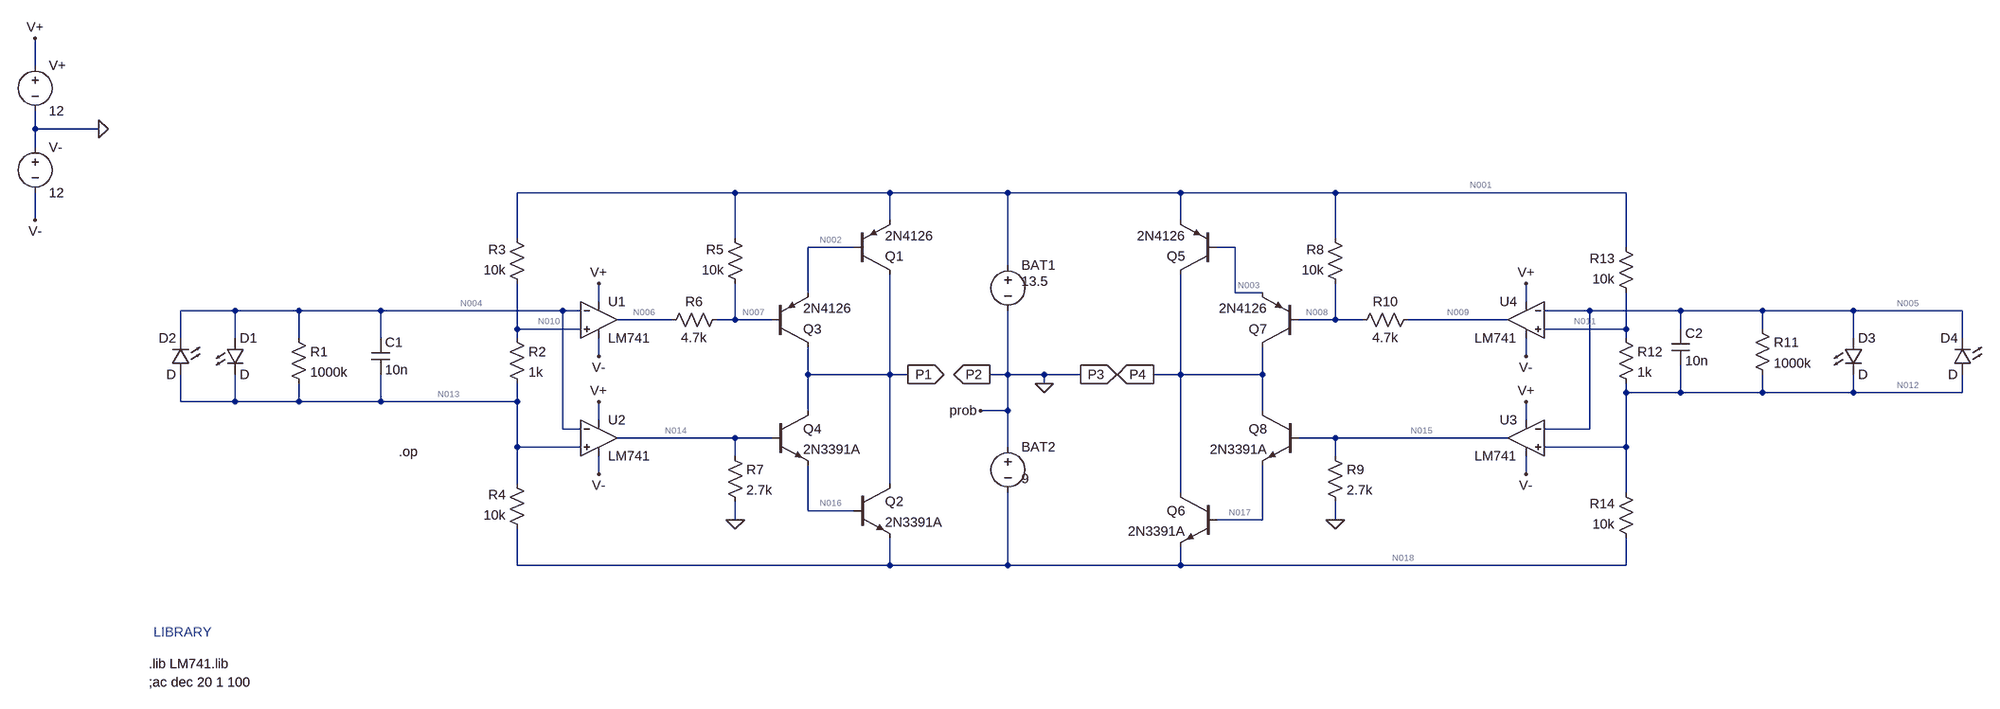
[diagram p0: schematic solar tracker.asc]
solar tracker.asc, the LTspice schematic file:
Version 4
SHEET 1 2612 828
WIRE -800 -416 -800 -464
WIRE -800 -304 -800 -336
WIRE -688 -304 -800 -304
WIRE -800 -272 -800 -304
WIRE 432 -192 48 -192
WIRE 704 -192 432 -192
WIRE 912 -192 704 -192
WIRE 1216 -192 912 -192
WIRE 1488 -192 1216 -192
WIRE 2000 -192 1488 -192
WIRE -800 -144 -800 -192
WIRE 704 -144 704 -192
WIRE 1216 -144 1216 -192
WIRE 48 -112 48 -192
WIRE 432 -112 432 -192
WIRE 1488 -112 1488 -192
WIRE 640 -96 560 -96
WIRE 1312 -96 1280 -96
WIRE 2000 -96 2000 -192
WIRE 912 -64 912 -192
WIRE 560 -16 560 -96
WIRE 1312 -16 1312 -96
WIRE 1360 -16 1312 -16
WIRE 192 0 192 -32
WIRE 1824 0 1824 -32
WIRE -448 16 -544 16
WIRE -336 16 -448 16
WIRE -192 16 -336 16
WIRE 128 16 -192 16
WIRE 160 16 128 16
WIRE 1936 16 1856 16
WIRE 2096 16 1936 16
WIRE 2240 16 2096 16
WIRE 2400 16 2240 16
WIRE 2592 16 2400 16
WIRE 320 32 224 32
WIRE 432 32 432 -32
WIRE 432 32 400 32
WIRE 496 32 432 32
WIRE 1488 32 1488 -32
WIRE 1488 32 1424 32
WIRE 1536 32 1488 32
WIRE 1792 32 1616 32
WIRE 48 48 48 -32
WIRE 160 48 48 48
WIRE 2000 48 2000 -16
WIRE 2000 48 1856 48
WIRE 2096 48 2096 16
WIRE 2240 48 2240 16
WIRE -544 64 -544 16
WIRE -448 64 -448 16
WIRE -336 64 -336 16
WIRE -192 64 -192 16
WIRE 48 64 48 48
WIRE 2000 64 2000 48
WIRE 2400 64 2400 16
WIRE 2592 64 2592 16
WIRE 192 96 192 64
WIRE 1824 96 1824 64
WIRE 560 128 560 80
WIRE 704 128 704 -48
WIRE 704 128 560 128
WIRE 736 128 704 128
WIRE 912 128 912 16
WIRE 912 128 880 128
WIRE 976 128 912 128
WIRE 1040 128 976 128
WIRE 1216 128 1216 -48
WIRE 1216 128 1168 128
WIRE 1360 128 1360 80
WIRE 1360 128 1216 128
WIRE 976 144 976 128
WIRE 2000 160 2000 144
WIRE 2096 160 2096 112
WIRE 2096 160 2000 160
WIRE 2240 160 2240 128
WIRE 2240 160 2096 160
WIRE 2400 160 2400 128
WIRE 2400 160 2240 160
WIRE 2592 160 2592 128
WIRE 2592 160 2400 160
WIRE -544 176 -544 128
WIRE -448 176 -448 128
WIRE -448 176 -544 176
WIRE -336 176 -336 144
WIRE -336 176 -448 176
WIRE -192 176 -192 128
WIRE -192 176 -336 176
WIRE 48 176 48 144
WIRE 48 176 -192 176
WIRE 560 192 560 128
WIRE 912 192 912 128
WIRE 912 192 864 192
WIRE 1360 192 1360 128
WIRE 192 208 192 176
WIRE 1824 208 1824 176
WIRE 128 224 128 16
WIRE 160 224 128 224
WIRE 1936 224 1936 16
WIRE 1936 224 1856 224
WIRE 432 240 224 240
WIRE 496 240 432 240
WIRE 1488 240 1424 240
WIRE 1792 240 1488 240
WIRE 48 256 48 176
WIRE 160 256 48 256
WIRE 912 256 912 192
WIRE 2000 256 2000 160
WIRE 2000 256 1856 256
WIRE 432 272 432 240
WIRE 1488 272 1488 240
WIRE 192 304 192 272
WIRE 1824 304 1824 272
WIRE 48 320 48 256
WIRE 704 320 704 128
WIRE 1216 336 1216 128
WIRE 2000 336 2000 256
WIRE 560 368 560 288
WIRE 640 368 560 368
WIRE 432 384 432 352
WIRE 1360 384 1360 288
WIRE 1360 384 1280 384
WIRE 1488 384 1488 352
WIRE 48 464 48 400
WIRE 704 464 704 416
WIRE 704 464 48 464
WIRE 912 464 912 336
WIRE 912 464 704 464
WIRE 1216 464 1216 432
WIRE 1216 464 912 464
WIRE 2000 464 2000 416
WIRE 2000 464 1216 464
FLAG -800 -464 V+
FLAG -800 -144 V-
FLAG -688 -304 0
FLAG 192 96 V-
FLAG 192 304 V-
FLAG 192 -32 V+
FLAG 192 176 V+
FLAG 432 384 0
FLAG 976 144 0
FLAG 736 128 P1
IOPIN 736 128 Out
FLAG 880 128 P2
IOPIN 880 128 Out
FLAG 1040 128 P3
IOPIN 1040 128 Out
FLAG 1168 128 P4
IOPIN 1168 128 Out
FLAG 1488 384 0
FLAG 1824 -32 V+
FLAG 1824 176 V+
FLAG 1824 96 V-
FLAG 1824 304 V-
FLAG 864 192 prob
SYMBOL res -352 48 R0
SYMATTR InstName R1
SYMATTR Value 1000k
SYMBOL cap -208 64 R0
SYMATTR InstName C1
SYMATTR Value 10n
SYMBOL Opamps\\opamp2 192 -32 R0
SYMATTR InstName U1
SYMATTR Value LM741
SYMBOL Opamps\\opamp2 192 176 R0
SYMATTR InstName U2
SYMATTR Value LM741
SYMBOL res 416 16 R90
WINDOW 0 0 56 VBottom 2
WINDOW 3 32 56 VTop 2
SYMATTR InstName R6
SYMATTR Value 4.7k
SYMBOL res 448 -16 R180
WINDOW 0 36 76 Left 2
WINDOW 3 36 40 Left 2
SYMATTR InstName R5
SYMATTR Value 10k
SYMBOL res 64 -16 R180
WINDOW 0 36 76 Left 2
WINDOW 3 36 40 Left 2
SYMATTR InstName R3
SYMATTR Value 10k
SYMBOL voltage -800 -432 R0
SYMATTR InstName V+
SYMATTR Value 12
SYMBOL voltage -800 -288 R0
SYMATTR InstName V-
SYMATTR Value 12
SYMBOL pnp 496 80 M180
SYMATTR InstName Q3
SYMATTR Value 2N4126
SYMBOL res 416 256 R0
SYMATTR InstName R7
SYMATTR Value 2.7k
SYMBOL npn 496 192 R0
SYMATTR InstName Q4
SYMATTR Value 2N3391A
SYMBOL pnp 640 -48 M180
SYMATTR InstName Q1
SYMATTR Value 2N4126
SYMBOL npn 640 320 R0
SYMATTR InstName Q2
SYMATTR Value 2N3391A
SYMBOL voltage 912 -80 R0
WINDOW 3 24 44 Left 2
WINDOW 123 24 44 Left 2
WINDOW 39 0 0 Left 2
SYMATTR Value 13.5
SYMATTR InstName BAT1
SYMBOL voltage 912 240 R0
WINDOW 3 24 72 Left 2
WINDOW 123 24 44 Left 2
WINDOW 39 0 0 Left 2
SYMATTR Value 9
SYMATTR InstName BAT2
SYMBOL res 64 416 R180
WINDOW 0 36 76 Left 2
WINDOW 3 36 40 Left 2
SYMATTR InstName R4
SYMATTR Value 10k
SYMBOL LED -464 64 R0
SYMATTR InstName D1
SYMBOL LED -528 128 R180
WINDOW 0 24 64 Left 2
WINDOW 3 24 0 Left 2
SYMATTR InstName D2
SYMBOL res 32 48 R0
SYMATTR InstName R2
SYMATTR Value 1k
SYMBOL pnp 1280 -48 R180
SYMATTR InstName Q5
SYMATTR Value 2N4126
SYMBOL pnp 1424 80 R180
SYMATTR InstName Q7
SYMATTR Value 2N4126
SYMBOL npn 1424 192 M0
SYMATTR InstName Q8
SYMATTR Value 2N3391A
SYMBOL npn 1280 336 M0
SYMATTR InstName Q6
SYMATTR Value 2N3391A
SYMBOL res 1504 -16 R180
WINDOW 0 36 76 Left 2
WINDOW 3 36 40 Left 2
SYMATTR InstName R8
SYMATTR Value 10k
SYMBOL res 1472 256 R0
SYMATTR InstName R9
SYMATTR Value 2.7k
SYMBOL res 1632 16 R90
WINDOW 0 0 56 VBottom 2
WINDOW 3 32 56 VTop 2
SYMATTR InstName R10
SYMATTR Value 4.7k
SYMBOL Opamps\\opamp2 1824 176 M0
SYMATTR InstName U3
SYMATTR Value LM741
SYMBOL Opamps\\opamp2 1824 -32 M0
SYMATTR InstName U4
SYMATTR Value LM741
SYMBOL cap 2080 48 R0
SYMATTR InstName C2
SYMATTR Value 10n
SYMBOL res 2224 32 R0
SYMATTR InstName R11
SYMATTR Value 1000k
SYMBOL LED 2384 64 R0
SYMATTR InstName D3
SYMBOL LED 2608 128 R180
WINDOW 0 24 64 Left 2
WINDOW 3 24 0 Left 2
SYMATTR InstName D4
SYMBOL res 1984 48 R0
SYMATTR InstName R12
SYMATTR Value 1k
SYMBOL res 2016 0 R180
WINDOW 0 36 76 Left 2
WINDOW 3 36 40 Left 2
SYMATTR InstName R13
SYMATTR Value 10k
SYMBOL res 2016 432 R180
WINDOW 0 36 76 Left 2
WINDOW 3 36 40 Left 2
SYMATTR InstName R14
SYMATTR Value 10k
TEXT -592 720 Left 2 ;LIBRARY
TEXT -600 776 Left 2 !.lib LM741.lib
TEXT -600 808 Left 2 !;ac dec 20 1 100
TEXT -160 264 Left 2 !.op

The netlist it stands for:
* solar tracker.asc
R1 N004 N013 1000k
C1 N004 N013 10n
XU1 N010 N004 V+ V- N006 LM741  ; pins In+ In- V+ V- OUT
XU2 N013 N004 V+ V- N014 LM741  ; pins In+ In- V+ V- OUT
R6 N007 N006 4.7k
R5 N007 N001 10k
R3 N010 N001 10k
V+ V+ 0 12
V- 0 V- 12
Q3 P1 N007 N002 0 2N4126
R7 N014 0 2.7k
Q4 P1 N014 N016 0 2N3391A
Q1 P1 N002 N001 0 2N4126
Q2 P1 N016 N018 0 2N3391A
V§BAT1 N001 0 13.5
V§BAT2 0 N018 9
R4 N018 N013 10k
D1 N004 N013 D
D2 N013 N004 D
R2 N010 N013 1k
Q5 P4 N003 N001 0 2N4126
Q7 P4 N008 N003 0 2N4126
Q8 P4 N015 N017 0 2N3391A
Q6 P4 N017 N018 0 2N3391A
R8 N008 N001 10k
R9 N015 0 2.7k
R10 N009 N008 4.7k
XU3 N012 N005 V+ V- N015 LM741  ; pins In+ In- V+ V- OUT
XU4 N011 N005 V+ V- N009 LM741  ; pins In+ In- V+ V- OUT
C2 N005 N012 10n
R11 N005 N012 1000k
D3 N005 N012 D
D4 N012 N005 D
R12 N011 N012 1k
R13 N011 N001 10k
R14 N018 N012 10k
.model D D
.lib standard.dio
.model NPN NPN
.model PNP PNP
.lib standard.bjt
* LIBRARY
.lib LM741.lib
;ac dec 20 1 100
.op
.backanno
.end

* Results of the author's LTspice run, read from the files saved beside the schematic
* Operating Point:
*   V(n004) = 2.096 V
*   V(n013) = 1.713 V
*   V(n010) = 2.783 V
*   V(v-) = -12 V
*   V(v+) = 12 V
*   V(n006) = 11.06 V
*   V(n014) = -10.83 V
*   V(n007) = 12.17 V
*   V(n001) = 13.5 V
*   V(p1) = 12.85 V
*   V(n002) = 12.85 V
*   V(n016) = -8.903 V
*   V(n018) = -9 V
*   V(p4) = 12.85 V
*   V(n003) = 12.85 V
*   V(n008) = 12.17 V
*   V(n015) = -10.83 V
*   V(n017) = -8.903 V
*   V(n009) = 11.06 V
*   V(n005) = 2.096 V
*   V(n012) = 1.713 V
*   V(n011) = 2.783 V
*   Ic(Q6) = 22.57 pA
*   Ib(Q6) = -4.876 pA
*   Ie(Q6) = -17.7 pA
*   Ic(Q8) = 23.69 pA
*   Ib(Q8) = -28.56 pA
*   Ie(Q8) = 4.876 pA
*   Ic(Q2) = 22.57 pA
*   Ib(Q2) = -4.876 pA
*   Ie(Q2) = -17.7 pA
*   Ic(Q4) = 23.69 pA
*   Ib(Q4) = -28.56 pA
*   Ie(Q4) = 4.876 pA
*   Ic(Q7) = 100.7 µA
*   Ib(Q7) = -101.2 µA
*   Ie(Q7) = 494.8 nA
*   Ic(Q5) = -100.7 µA
*   Ib(Q5) = -494.8 nA
*   Ie(Q5) = 101.2 µA
*   Ic(Q1) = -100.7 µA
*   Ib(Q1) = -494.8 nA
*   Ie(Q1) = 101.2 µA
*   Ic(Q3) = 100.7 µA
*   Ib(Q3) = -101.2 µA
*   Ie(Q3) = 494.8 nA
*   I(C2) = 0 A
*   I(C1) = 0 A
*   I(D4) = -392.8 fA
*   I(D3) = 26.73 nA
*   I(D2) = -392.8 fA
*   I(D1) = 26.73 nA
*   I(R14) = -1.071 mA
*   I(R13) = -1.072 mA
*   I(R12) = 1.07 mA
*   I(R11) = 382.8 nA
*   I(R10) = -234.6 µA
*   I(R9) = -4.01 mA
*   I(R8) = -133.4 µA
*   I(R2) = 1.07 mA
*   I(R4) = -1.071 mA
*   I(R7) = -4.01 mA
*   I(R3) = -1.072 mA
*   I(R5) = -133.4 µA
*   I(R6) = 234.6 µA
*   I(R1) = 382.8 nA
*   I(Bat2) = -2.143 mA
*   I(Bat1) = -2.613 mA
*   I(V-) = -14.51 mA
*   I(V+) = -6.023 mA
* From the log:
*   Semiconductor Device Operating Points:
*                           --- Diodes ---
*   Name:    d:u4:3      d:u4:4      d:u4:6      d:u4:5      d:u4:2
*   Model:    u4:dx       u4:dx       u4:dx       u4:dx       u4:dx
*   Id:     -2.17e-13   -1.45e-13    2.02e-05    2.55e-04   -2.14e-11
*   Vd:     -2.16e-01   -1.44e-01    6.14e-01    6.79e-01   -2.14e+01
*   Req:     1.00e+12    1.00e+12    1.28e+03    1.01e+02    1.00e+12
*   CAP:     0.00e+00    0.00e+00    0.00e+00    0.00e+00    0.00e+00
*   Name:    d:u4:1      d:u3:3      d:u3:4      d:u3:6      d:u3:5
*   Model:    u4:dx       u3:dx       u3:dx       u3:dx       u3:dx
*   Id:      1.08e-04   -3.82e-13    2.21e-14    3.48e-08    4.01e-03
*   Vd:      6.57e-01   -3.81e-01    2.08e-02    4.49e-01    7.51e-01
*   Req:     2.39e+02    1.00e+12    9.20e+11    7.43e+05    6.45e+00
*   CAP:     0.00e+00    0.00e+00    0.00e+00    0.00e+00    0.00e+00
*   Name:    d:u3:2      d:u3:1        d4          d3          d2
*   Model:    u3:dx       u3:dx         d           d           d
*   Id:      1.08e-04   -2.14e-11   -3.93e-13    2.67e-08   -3.93e-13
*   Vd:      6.57e-01   -2.14e+01   -3.83e-01    3.83e-01   -3.83e-01
*   Req:     2.39e+02    1.00e+12    1.00e+12    9.68e+05    1.00e+12
*   CAP:     0.00e+00    0.00e+00    0.00e+00    0.00e+00    0.00e+00
*   Name:      d1        d:u2:3      d:u2:4      d:u2:6      d:u2:5
*   Model:      d         u2:dx       u2:dx       u2:dx       u2:dx
*   Id:      2.67e-08   -3.82e-13    2.21e-14    3.48e-08    4.01e-03
*   Vd:      3.83e-01   -3.81e-01    2.08e-02    4.49e-01    7.51e-01
*   Req:     9.68e+05    1.00e+12    9.20e+11    7.43e+05    6.45e+00
*   CAP:     0.00e+00    0.00e+00    0.00e+00    0.00e+00    0.00e+00
*   Name:    d:u2:2      d:u2:1      d:u1:3      d:u1:4      d:u1:6
*   Model:    u2:dx       u2:dx       u1:dx       u1:dx       u1:dx
*   Id:      1.08e-04   -2.14e-11   -2.17e-13   -1.45e-13    2.02e-05
*   Vd:      6.57e-01   -2.14e+01   -2.16e-01   -1.44e-01    6.14e-01
*   Req:     2.39e+02    1.00e+12    1.00e+12    1.00e+12    1.28e+03
*   CAP:     0.00e+00    0.00e+00    0.00e+00    0.00e+00    0.00e+00
*   Name:    d:u1:5      d:u1:2      d:u1:1
*   Model:    u1:dx       u1:dx       u1:dx
*   Id:      2.55e-04   -2.14e-11    1.08e-04
*   Vd:      6.79e-01   -2.14e+01    6.57e-01
*   Req:     1.01e+02    1.00e+12    2.39e+02
*   CAP:     0.00e+00    0.00e+00    0.00e+00
*                           --- Bipolar Transistors ---
*   Name:     q:u4:2      q:u4:1      q:u3:2      q:u3:1        q6
*   Model:     u4:qx       u4:qx       u3:qx       u3:qx      2n3391a
*   Ib:       1.60e-07   -9.88e-12   -9.89e-12    1.60e-07   -4.88e-12
*   Ic:       9.98e-05    9.90e-12    4.92e-11    9.98e-05    2.26e-11
*   Vbe:      7.15e-01    2.62e-02    3.33e-01    7.15e-01    9.69e-02
*   Vbc:     -9.16e+00   -9.90e+00   -1.03e+01   -9.85e+00   -2.18e+01
*   Vce:      9.88e+00    9.93e+00    1.06e+01    1.06e+01    2.19e+01
*   BetaDC:   6.25e+02   -1.00e+00   -4.97e+00    6.25e+02   -4.63e+00
*   Gm:       3.86e-03    1.06e-14    1.50e-09    3.86e-03    3.11e-11
*   Rpi:      1.62e+05    1.00e+12    2.93e+11    1.62e+05    2.57e+09
*   Rx:       0.00e+00    0.00e+00    0.00e+00    0.00e+00    1.00e+01
*   Ro:         NaN         NaN         NaN         NaN       7.34e+13
*   Cbe:      0.00e+00    0.00e+00    0.00e+00    0.00e+00    8.76e-12
*   Cbc:      0.00e+00    0.00e+00    0.00e+00    0.00e+00    1.95e-12
*   Cjs:      0.00e+00    0.00e+00    0.00e+00    0.00e+00    0.00e+00
*   BetaAC:   6.25e+02    1.06e-02    4.42e+02    6.25e+02    8.02e-02
*   Cbx:      0.00e+00    0.00e+00    0.00e+00    0.00e+00    0.00e+00
*   Ft:       0.00e+00    0.00e+00    0.00e+00    0.00e+00    5.76e+00
*   Name:       q8          q2          q4          q7          q5
*   Model:    2n3391a     2n3391a     2n3391a     2n4126      2n4126
*   Ib:      -2.86e-11   -4.88e-12   -2.86e-11   -1.01e-04   -4.95e-07
*   Ic:       2.37e-11    2.26e-11    2.37e-11    1.01e-04   -1.01e-04
*   Vbe:     -1.92e+00    9.69e-02   -1.92e+00   -6.88e-01   -6.46e-01
*   Vbc:     -2.37e+01   -2.18e+01   -2.37e+01   -6.88e-01   -3.56e-04
*   Vce:      2.18e+01    2.19e+01    2.18e+01    3.56e-04   -6.46e-01
*   BetaDC:  -8.29e-01   -4.63e+00   -8.29e-01   -9.95e-01    2.03e+02
*   Gm:       3.88e-45    3.11e-11    3.88e-45   -7.23e-05    3.88e-03
*   Rpi:      1.00e+12    2.57e+09    1.00e+12    1.09e+04    5.23e+04
*   Rx:       1.00e+01    1.00e+01    1.00e+01    1.00e+01    1.00e+01
*   Ro:       0.00e+00    7.34e+13    0.00e+00    5.55e+01    1.86e+05
*   Cbe:      5.10e-12    8.76e-12    5.10e-12    1.68e-11    1.39e-11
*   Cbc:      1.90e-12    1.95e-12    1.90e-12    6.46e-10    9.73e-12
*   Cjs:      0.00e+00    0.00e+00    0.00e+00    0.00e+00    0.00e+00
*   BetaAC:   3.88e-33    8.02e-02    3.88e-33   -7.86e-01    2.03e+02
*   Cbx:      0.00e+00    0.00e+00    0.00e+00    0.00e+00    0.00e+00
*   Ft:       2.28e-02    5.76e+00    2.28e-02    1.36e+04    2.62e+07
*   Name:       q1          q3        q:u2:2      q:u2:1      q:u1:2
*   Model:    2n4126      2n4126       u2:qx       u2:qx       u1:qx
*   Ib:      -4.95e-07   -1.01e-04   -9.89e-12    1.60e-07    1.60e-07
*   Ic:      -1.01e-04    1.01e-04    4.92e-11    9.98e-05    9.98e-05
*   Vbe:     -6.46e-01   -6.88e-01    3.33e-01    7.15e-01    7.15e-01
*   Vbc:     -3.56e-04   -6.88e-01   -1.03e+01   -9.85e+00   -9.16e+00
*   Vce:     -6.46e-01    3.56e-04    1.06e+01    1.06e+01    9.88e+00
*   BetaDC:   2.03e+02   -9.95e-01   -4.97e+00    6.25e+02    6.25e+02
*   Gm:       3.88e-03   -7.23e-05    1.50e-09    3.86e-03    3.86e-03
*   Rpi:      5.23e+04    1.09e+04    2.93e+11    1.62e+05    1.62e+05
*   Rx:       1.00e+01    1.00e+01    0.00e+00    0.00e+00    0.00e+00
*   Ro:       1.86e+05    5.55e+01      NaN         NaN         NaN
*   Cbe:      1.39e-11    1.68e-11    0.00e+00    0.00e+00    0.00e+00
*   Cbc:      9.73e-12    6.46e-10    0.00e+00    0.00e+00    0.00e+00
*   Cjs:      0.00e+00    0.00e+00    0.00e+00    0.00e+00    0.00e+00
*   BetaAC:   2.03e+02   -7.86e-01    4.42e+02    6.25e+02    6.25e+02
*   Cbx:      0.00e+00    0.00e+00    0.00e+00    0.00e+00    0.00e+00
*   Ft:       2.62e+07    1.36e+04    0.00e+00    0.00e+00    0.00e+00
*   Name:     q:u1:1
*   Model:     u1:qx
*   Ib:      -9.88e-12
*   Ic:       9.90e-12
*   Vbe:      2.62e-02
*   Vbc:     -9.90e+00
*   Vce:      9.93e+00
*   BetaDC:  -1.00e+00
*   Gm:       1.06e-14
*   Rpi:      1.00e+12
*   Rx:       0.00e+00
*   Ro:         NaN
*   Cbe:      0.00e+00
*   Cbc:      0.00e+00
*   Cjs:      0.00e+00
*   BetaAC:   1.06e-02
*   Cbx:      0.00e+00
*   Ft:       0.00e+00